# EAGLE design topwithprogport (EAGLE 6.4)
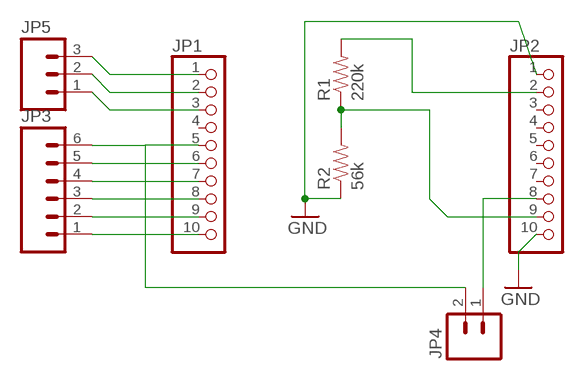
[diagram p0: schematic, sheet 1]

## Parts
JP1  PINHD-1X10  [1X10]
JP2  PINHD-1X10  [1X10]
JP3  M06LONGPADS  [1X06_LONGPADS]
JP4  M02LOCK_LONGPADS  [1X02_LOCK_LONGPADS]
JP5  M03LOCK_LONGPADS  [1X03_LOCK_LONGPADS]
R1  220k  RESISTORPTH-1/4W  [AXIAL-0.4]
R2  56k  RESISTORPTH-1/4W  [AXIAL-0.4]

## Nets
GND: JP1.1 JP2.1 JP2.10 JP5.3 R2.P$1
N$1: JP2.9 R1.P$1 R2.P$2
N$2: JP2.2 R1.P$2
N$3: JP2.8 JP4.1
N$4: JP1.5 JP3.6 JP4.2
N$5: JP1.6 JP3.5
N$6: JP1.7 JP3.4
N$7: JP1.8 JP3.3
N$9: JP1.9 JP3.2
N$10: JP1.10 JP3.1
N$12: JP1.2 JP5.2
N$13: JP1.3 JP5.1
Unconnected: JP1.4 JP2.3 JP2.4 JP2.5 JP2.6 JP2.7

## Library data of the parts
JP1 JP2 = pinhead:PINHD-1X10: PIN HEADER
JP3 = SparkFun-Connectors:M06: Header 6 Standard 6-pin 0.1" header. Use with straight break away headers (SKU : PRT-00116), right angle break away headers (PRT-00553), swiss pins (PRT-00743), machine pins (PRT-00117), and female headers (PRT-00115). Molex polarized connector foot print use with SKU : PRT-08094 with associated crimp pins and housings. NOTES ON THE VARIANTS LOCK and LOCK_LONGPADS... This footprint was designed to help hold the alignment of a through-hole component (i.e. 6-pin header) while soldering it into place. You may notice that each hole has been shifted either up or down by 0.005 of an inch from it's more standard position (which is a perfectly straight line). This slight alteration caused the pins (the squares in the middle) to touch the edges of the holes. Because they are alternating, it causes a "brace" to hold the component in place. 0.005 has proven to be the perfect amount of "off-center" position when using our standard breakaway headers. Although looks a little odd when you look at the bare footprint, once you have a header in there, the alteration is very hard to notice. Also,if you push a header all the way into place, it is covered up entirely on the bottom side. This idea of altering the position of holes to aid alignment will be further integrated into the Sparkfun Library for other footprints. It can help hold any component with 3 or more connection pins.
JP4 = SparkFun-Connectors:M02: Standard 2-pin 0.1" header. Use with - straight break away headers ( PRT-00116) - right angle break away headers (PRT-00553) - swiss pins (PRT-00743) - machine pins (PRT-00117) - female headers (PRT-00115) Molex polarized connector foot print use with: PRT-08233 with associated crimp pins and housings. 2.54_SCREWTERM for use with PRT-10571. 3.5mm Screw Terminal footprints for PRT-08084 5mm Screw Terminal footprints for use with PRT-08432
JP5 = SparkFun-Connectors:M03: Header 3 Standard 3-pin 0.1" header. Use with straight break away headers (SKU : PRT-00116), right angle break away headers (PRT-00553), swiss pins (PRT-00743), machine pins (PRT-00117), and female headers (PRT-00115). Molex polarized connector foot print use with SKU : PRT-08232 with associated crimp pins and housings.
R1 R2 = SparkFun-Passives:RESISTOR: Resistor Basic schematic elements and footprints for 0603, 1206, and PTH resistors.

## Board
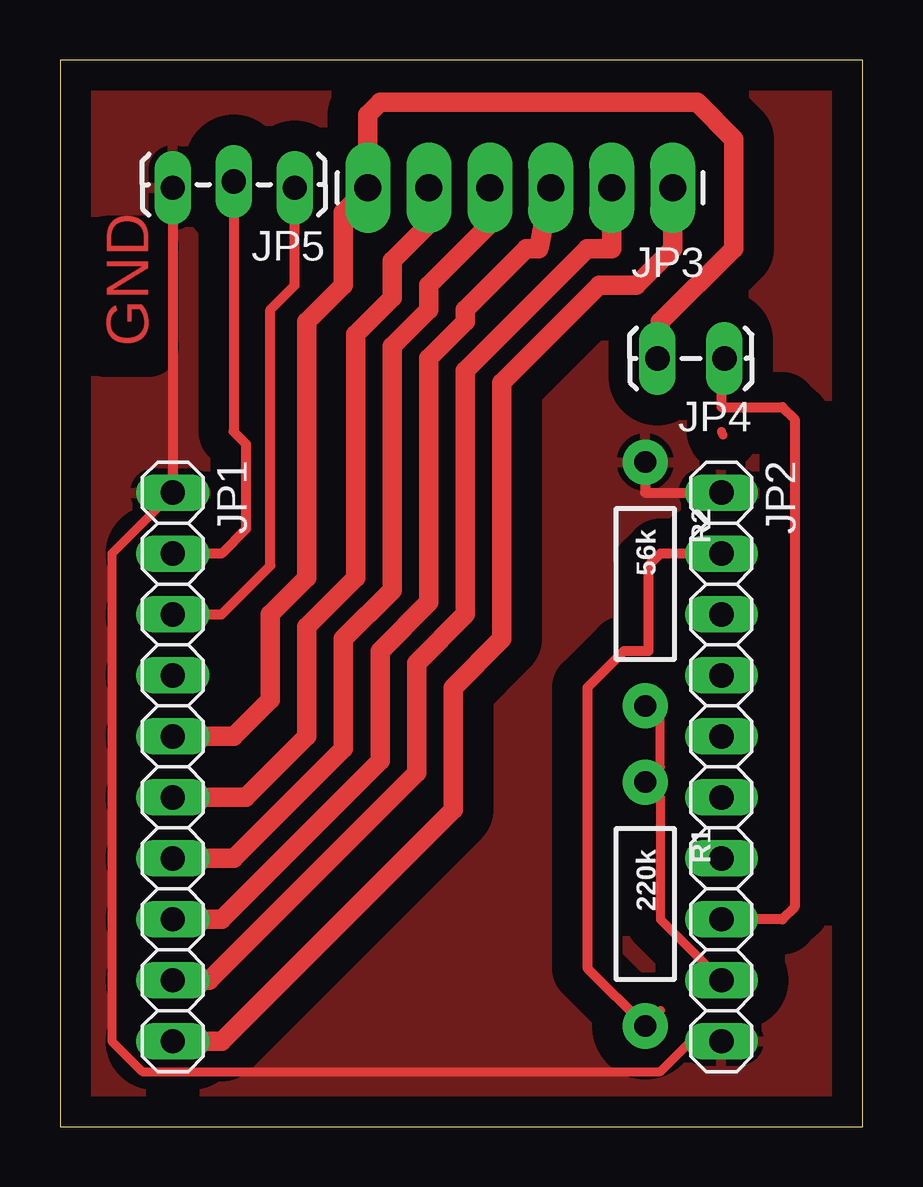
[diagram p1: board, top side]

Size 33.45 x 44.44 mm. Coordinates in mm from the lower left corner, seen from the top.
Outline: 0,0 33.45,0 33.45,44.44 0,44.44 0,0
Copper layers (1*16): Top 0.035mm / dielectric 1.5mm / Bottom 0.035mm
Design rules "default *": minimum track width 15mil, minimum drill 24mil, track to track 10mil, track to pad 8mil, pad to pad 8mil, via to via 8mil, smd to smd 8mil, copper to edge 40mil, drill to drill 8mil, minimum pad ring 10mil, minimum via ring 8mil, stop-mask expansion 4mil, vias tented up to drill 0mil, thermal gap 10mil

### Footprints (pad centres in the part's own frame; a part is rotated, then mirrored left to right if it is on the bottom)
1X10 = drill 1.016 long: 1 -11.43,0; 2 -8.89,0; 3 -6.35,0; 4 -3.81,0; 5 -1.27,0; 6 1.27,0; 7 3.81,0; 8 6.35,0; 9 8.89,0; 10 11.43,0
1X06_LONGPADS = drill 1.118 pad 1.88 long: 1 0,0; 2 2.54,0; 3 5.08,0; 4 7.62,0; 5 10.16,0; 6 12.7,0
1X02_LOCK_LONGPADS = drill 1.016 long: 1 -0.127,0; 2 2.667,0
1X03_LOCK_LONGPADS = drill 1.016 long: 1 0,0; 2 2.54,-0.254; 3 5.08,0
AXIAL-0.4 = drill 0.9 pad 1.88: P$1 -5.08,0; P$2 5.08,0

### Placement (x,y rotation side)
JP1  4.7,14.99 270 top
JP2  27.56,14.99 270 top
JP3  25.53,39.12 180 top
JP4  27.56,32 180 top
JP5  9.78,39.12 180 top
R1  24.38,9.27 270 top
R2  24.38,22.61 270 top

### Tracks (layer width: path | path; a pad name or v marks a point on that pad's centre or on a via)
GND
  Top 0.381: JP2.10 26.29,3.56 25.02,2.29 3.43,2.29 2.16,3.56 2.16,23.88 JP1.1
  Top 0.406: JP5.3 JP1.1 | R2.P$1 24.38,26.42 JP2.1
  pour Top (isolate 1.27): 1.14,43.69 32.64,43.69 32.64,0.51 1.14,0.51
N$1
  Top 0.381: JP2.9 25.02,8.64 25.02,13.72 R1.P$1 25.02,14.99 25.02,17.53 R2.P$2
N$2
  Top 0.381: 28.83,23.88 JP2.2 | 25.02,4.83 R1.P$2
  Top 0.406: 28.83,23.88 25.02,23.88 24.51,23.37 24.51,19.81 23.5,19.81 21.97,18.29 21.97,6.6 R1.P$2
N$3
  Top 0.406: JP4.1 27.56,31.88 27.56,29.97 30.1,29.97 30.61,29.46 30.61,9.14 30.1,8.64 JP2.8
N$4
  Top 0.813: JP1.5 7.24,16.26 8.76,17.78 8.76,21.34 10.29,22.86 10.29,33.53 11.81,35.05 11.81,38.1 JP3.6 12.83,42.16 13.33,42.67 26.54,42.67 28.07,41.15 28.07,36.58 25.02,33.53 25.02,32.13 JP4.2
N$5
  Top 0.813: JP1.6 7.75,13.72 10.29,16.26 10.29,20.83 12.32,22.86 12.32,33.02 13.84,34.54 13.84,36.07 15.37,37.59 JP3.5
N$6
  Top 0.813: JP3.4 17.91,37.59 15.37,35.05 15.37,34.04 13.84,32.51 13.84,22.35 11.81,20.32 11.81,15.75 7.24,11.18 JP1.7
N$7
  Top 0.813: JP3.3 19.94,36.58 19.43,36.58 16.89,34.04 16.89,33.53 15.37,32 15.37,21.84 13.33,19.81 13.33,15.24 6.73,8.64 JP1.8
N$8
  Top 0.381: 27.56,28.96 27.62,28.81
N$9
  Top 0.813: JP3.2 22.99,36.58 21.97,36.58 16.89,31.5 16.89,21.34 14.86,19.3 14.86,14.73 6.22,6.1 JP1.9
N$10
  Top 0.813: JP1.10 6.73,3.56 16.38,13.21 16.38,18.29 18.41,20.32 18.41,30.99 22.48,35.05 24,35.05 25.53,36.58 JP3.1
N$12
  Top 0.406: JP5.2 7.24,28.96 7.75,28.45 7.75,24.89 6.73,23.88 JP1.2
N$13
  Top 0.406: JP1.3 6.73,21.34 8.76,23.37 8.76,34.04 9.78,35.05 JP5.1

### Text on the board
Top: GND